# Altium project +12V0 Power Board.PrjPcb
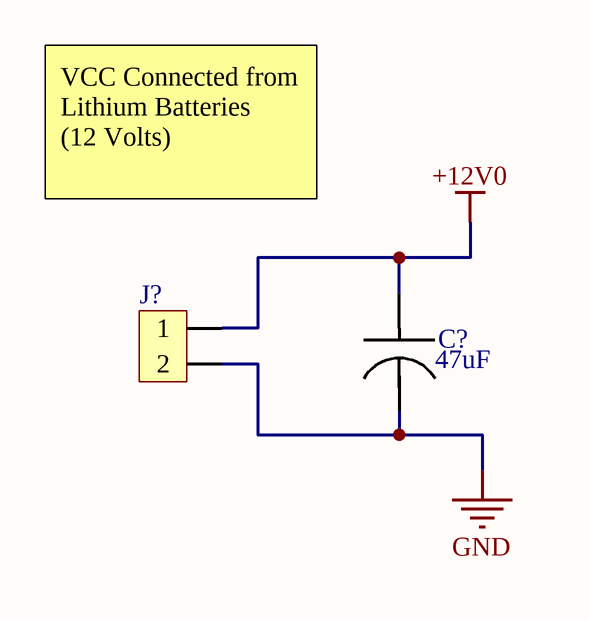
[diagram p0: Power.SchDoc]
1 sheet, 2 parts. Net scope: global (net labels, ports and power ports of the same name join across sheets).
Board file: Power.PcbDoc

## Sheet Power.SchDoc
size A; SheetNumber: 1; SheetTotal: 1

### Parts
C3  value 47uF  [ALCap.]  (hidden comment: ALCapacitor)
J4  Terminal Block 2-pins  [Terminal Block 2 Plugable]  (value not drawn)

### Nets
+12V0: C3.1 J4.1
GND: C3.2 J4.2

### Notes on the sheet
- VCC Connected from Lithium Batteries
  (12 Volts)

### Library data of the parts
J4 = Terminal Block 2-pins: PN: 1935161; MF: Phoenix Contact; Supplier: Digikey; Supplier PN: 277-1667-ND